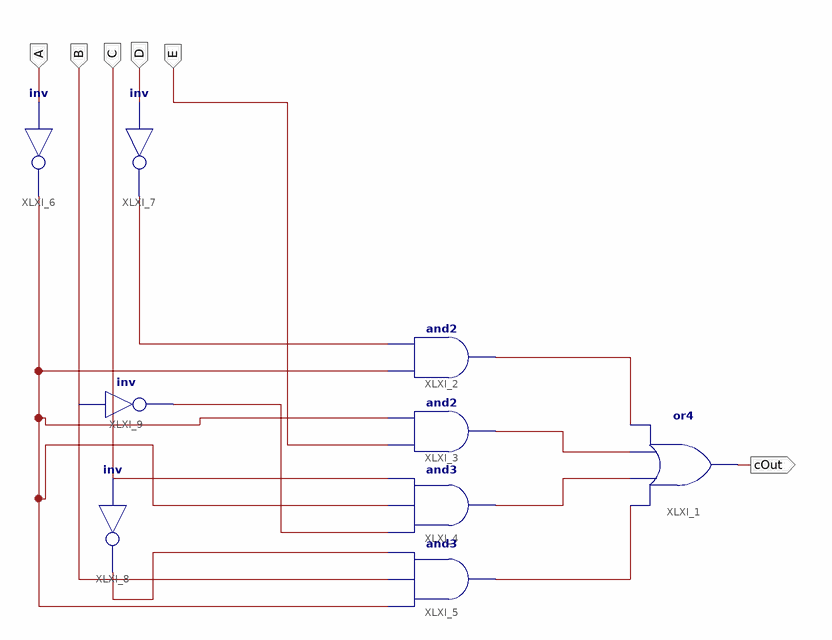
[diagram p0: schematic sheet 1]
// Xilinx ISE schematic c.sch (xa9500xl) as structural Verilog: 9 symbols, 6 ports
module c (
  input  A,
  input  B,
  input  C,
  input  D,
  input  E,
  output cOut
);

  wire XLXN_1, XLXN_2, XLXN_3, XLXN_4, XLXN_24, XLXN_27, XLXN_28, XLXN_30;

  or XLXI_1 (cOut, XLXN_4, XLXN_3, XLXN_2, XLXN_1);
  and XLXI_2 (XLXN_1, XLXN_24, XLXN_30);
  and XLXI_3 (XLXN_2, E, XLXN_24);
  and XLXI_4 (XLXN_3, XLXN_28, XLXN_24, C);
  and XLXI_5 (XLXN_4, XLXN_24, B, XLXN_27);
  not XLXI_6 (XLXN_24, A);
  not XLXI_7 (XLXN_30, D);
  not XLXI_8 (XLXN_27, C);
  not XLXI_9 (XLXN_28, B);
endmodule
